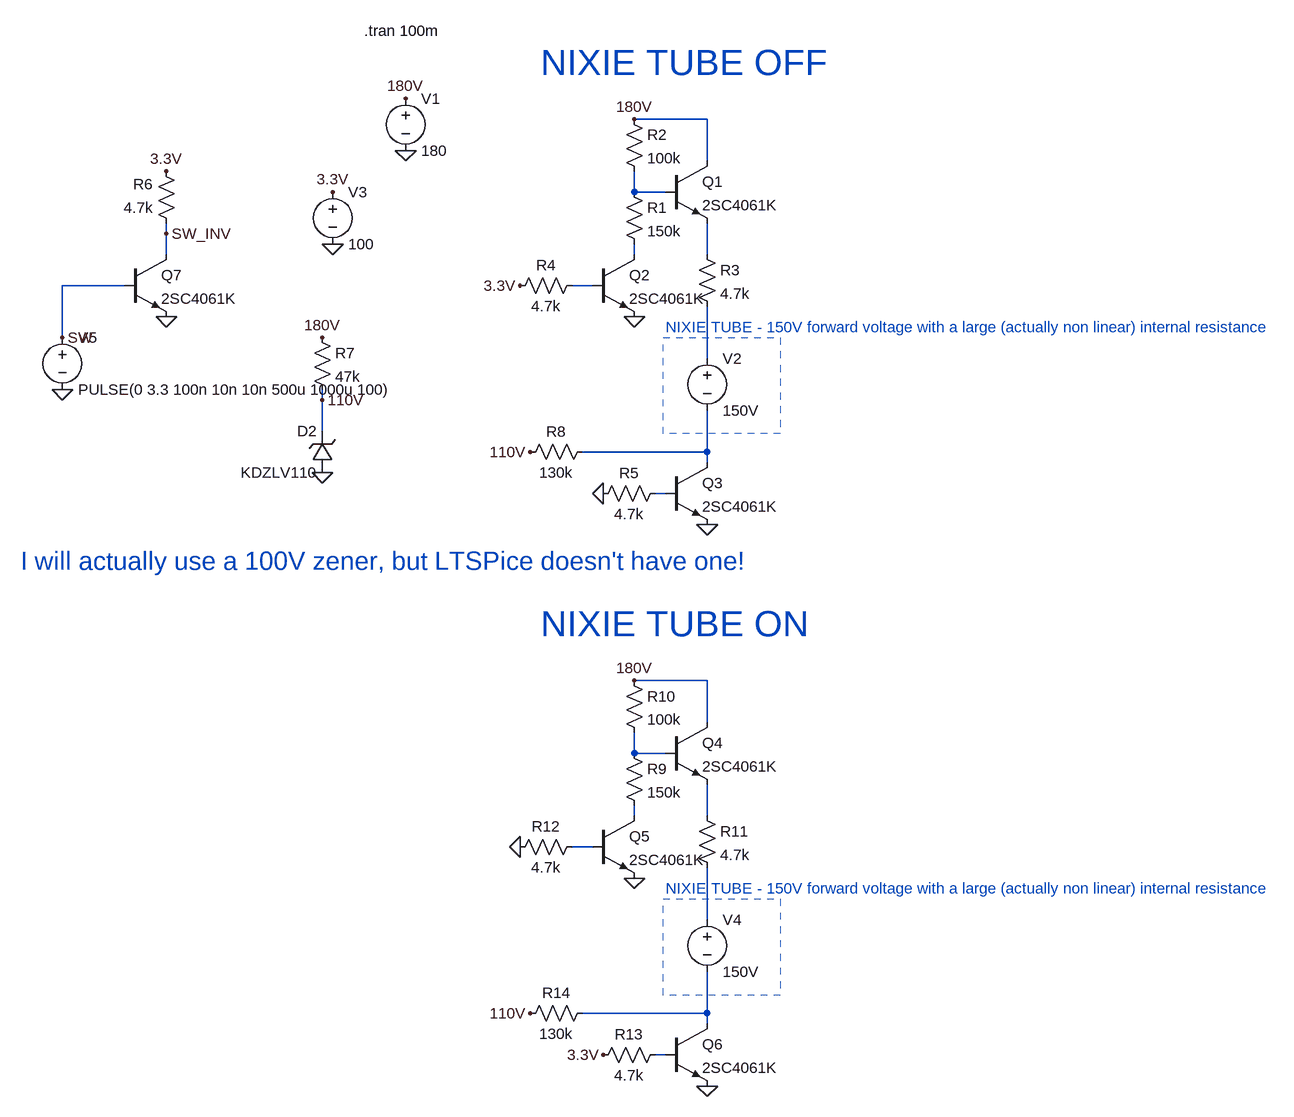
[diagram p0: schematic LTSpice Simulation of Nixie Tube Anode and Cathode Drivers.asc]
LTSpice Simulation of Nixie Tube Anode and Cathode Drivers.asc, the LTspice schematic file:
Version 4
SHEET 1 1408 1696
WIRE 544 192 432 192
WIRE 544 256 544 192
WIRE 432 304 432 272
WIRE 480 304 432 304
WIRE -288 368 -288 352
WIRE -288 400 -288 368
WIRE 432 400 432 384
WIRE 544 400 544 352
WIRE -352 448 -448 448
WIRE 368 448 336 448
WIRE -448 528 -448 448
WIRE 544 560 544 480
WIRE -48 624 -48 608
WIRE -48 672 -48 624
WIRE 544 704 544 640
WIRE 544 704 352 704
WIRE 544 720 544 704
WIRE 480 768 464 768
WIRE 544 1056 432 1056
WIRE 544 1120 544 1056
WIRE 432 1168 432 1136
WIRE 480 1168 432 1168
WIRE 432 1264 432 1248
WIRE 544 1264 544 1216
WIRE 368 1312 336 1312
WIRE 544 1424 544 1344
WIRE 544 1568 544 1504
WIRE 544 1568 352 1568
WIRE 544 1584 544 1568
WIRE 480 1632 464 1632
FLAG 80 160 180V
FLAG 80 240 0
FLAG 432 192 180V
FLAG 432 496 0
FLAG -32 384 0
FLAG -32 304 3.3V
FLAG -48 528 180V
FLAG -48 624 110V
FLAG 272 704 110V
FLAG 544 816 0
FLAG 432 1056 180V
FLAG 432 1360 0
FLAG 272 1568 110V
FLAG 544 1680 0
FLAG -48 736 0
FLAG -448 608 0
FLAG -448 528 SW
FLAG -288 272 3.3V
FLAG -288 496 0
FLAG -288 368 SW_INV
FLAG 256 448 3.3V
FLAG 384 1632 3.3V
FLAG 384 768 0
FLAG 256 1312 0
SYMBOL voltage 80 144 R0
SYMATTR InstName V1
SYMATTR Value 180
SYMBOL npn 480 256 R0
SYMATTR InstName Q1
SYMATTR Value 2SC4061K
SYMBOL npn 368 400 R0
SYMATTR InstName Q2
SYMATTR Value 2SC4061K
SYMBOL res 416 288 R0
SYMATTR InstName R1
SYMATTR Value 150k
SYMBOL res 416 176 R0
SYMATTR InstName R2
SYMATTR Value 100k
SYMBOL res 528 384 R0
SYMATTR InstName R3
SYMATTR Value 4.7k
SYMBOL res 352 432 R90
WINDOW 0 0 56 VBottom 2
WINDOW 3 32 56 VTop 2
SYMATTR InstName R4
SYMATTR Value 4.7k
SYMBOL voltage -32 288 R0
SYMATTR InstName V3
SYMATTR Value 100
SYMBOL npn 480 720 R0
SYMATTR InstName Q3
SYMATTR Value 2SC4061K
SYMBOL res 480 752 R90
WINDOW 0 0 56 VBottom 2
WINDOW 3 32 56 VTop 2
SYMATTR InstName R5
SYMATTR Value 4.7k
SYMBOL res -64 512 R0
SYMATTR InstName R7
SYMATTR Value 47k
SYMBOL res 368 688 R90
WINDOW 0 0 56 VBottom 2
WINDOW 3 32 56 VTop 2
SYMATTR InstName R8
SYMATTR Value 130k
SYMBOL voltage 544 544 R0
SYMATTR InstName V2
SYMATTR Value 150V
SYMATTR SpiceLine Rser=2000
SYMBOL npn 480 1120 R0
SYMATTR InstName Q4
SYMATTR Value 2SC4061K
SYMBOL npn 368 1264 R0
SYMATTR InstName Q5
SYMATTR Value 2SC4061K
SYMBOL res 416 1152 R0
SYMATTR InstName R9
SYMATTR Value 150k
SYMBOL res 416 1040 R0
SYMATTR InstName R10
SYMATTR Value 100k
SYMBOL res 528 1248 R0
SYMATTR InstName R11
SYMATTR Value 4.7k
SYMBOL res 352 1296 R90
WINDOW 0 0 56 VBottom 2
WINDOW 3 32 56 VTop 2
SYMATTR InstName R12
SYMATTR Value 4.7k
SYMBOL npn 480 1584 R0
SYMATTR InstName Q6
SYMATTR Value 2SC4061K
SYMBOL res 480 1616 R90
WINDOW 0 0 56 VBottom 2
WINDOW 3 32 56 VTop 2
SYMATTR InstName R13
SYMATTR Value 4.7k
SYMBOL res 368 1552 R90
WINDOW 0 0 56 VBottom 2
WINDOW 3 32 56 VTop 2
SYMATTR InstName R14
SYMATTR Value 130k
SYMBOL voltage 544 1408 R0
SYMATTR InstName V4
SYMATTR Value 150V
SYMATTR SpiceLine Rser=2000
SYMBOL zener -32 736 R180
WINDOW 0 24 64 Left 2
WINDOW 3 24 0 Left 2
SYMATTR InstName D2
SYMATTR Value KDZLV110
SYMBOL voltage -448 512 R0
SYMATTR InstName V5
SYMATTR Value PULSE(0 3.3 100n 10n 10n 500u 1000u 100)
SYMBOL npn -352 400 R0
SYMATTR InstName Q7
SYMATTR Value 2SC4061K
SYMBOL res -272 368 R180
WINDOW 0 36 76 Left 2
WINDOW 3 36 40 Left 2
SYMATTR InstName R6
SYMATTR Value 4.7k
TEXT 16 56 Left 2 !.tran 100m
TEXT 480 512 Left 2 ;NIXIE TUBE - 150V forward voltage with a large (actually non linear) internal resistance
TEXT 288 104 Left 5 ;NIXIE TUBE OFF
TEXT 480 1376 Left 2 ;NIXIE TUBE - 150V forward voltage with a large (actually non linear) internal resistance
TEXT 288 968 Left 5 ;NIXIE TUBE ON
TEXT -512 872 Left 4 ;I will actually use a 100V zener, but LTSPice doesn't have one!
RECTANGLE Normal 476 528 656 676 2
RECTANGLE Normal 476 1392 656 1540 2

The netlist it stands for:
* LTSpice Simulation of Nixie Tube Anode and Cathode Drivers.asc
V1 180V 0 180
Q1 180V N001 N003 0 2SC4061K
Q2 N002 N004 0 0 2SC4061K
R1 N001 N002 150k
R2 180V N001 100k
R3 N003 N005 4.7k
R4 N004 3.3V 4.7k
V3 3.3V 0 100
Q3 N006 N007 0 0 2SC4061K
R5 N007 0 4.7k
R7 180V 110V 47k
R8 N006 110V 130k
V2 N005 N006 150V Rser=2000
Q4 180V N008 N010 0 2SC4061K
Q5 N009 N011 0 0 2SC4061K
R9 N008 N009 150k
R10 180V N008 100k
R11 N010 N012 4.7k
R12 N011 0 4.7k
Q6 N013 N014 0 0 2SC4061K
R13 N014 3.3V 4.7k
R14 N013 110V 130k
V4 N012 N013 150V Rser=2000
D2 0 110V KDZLV110
V5 SW 0 PULSE(0 3.3 100n 10n 10n 500u 1000u 100)
Q7 SW_INV SW 0 0 2SC4061K
R6 SW_INV 3.3V 4.7k
.model D D
.lib standard.dio
.model NPN NPN
.model PNP PNP
.lib standard.bjt
.tran 100m
* NIXIE TUBE - 150V forward voltage with a large (actually non linear) internal resistance
* NIXIE TUBE OFF
* NIXIE TUBE - 150V forward voltage with a large (actually non linear) internal resistance
* NIXIE TUBE ON
* I will actually use a 100V zener, but LTSPice doesn't have one!
.backanno
.end